# EAGLE schematic FRA_Sensor_v1 (EAGLE 9.6.2)
CNAME: FRA Sensor Unit; CREVISION: 06

## Sheet 1 of 5
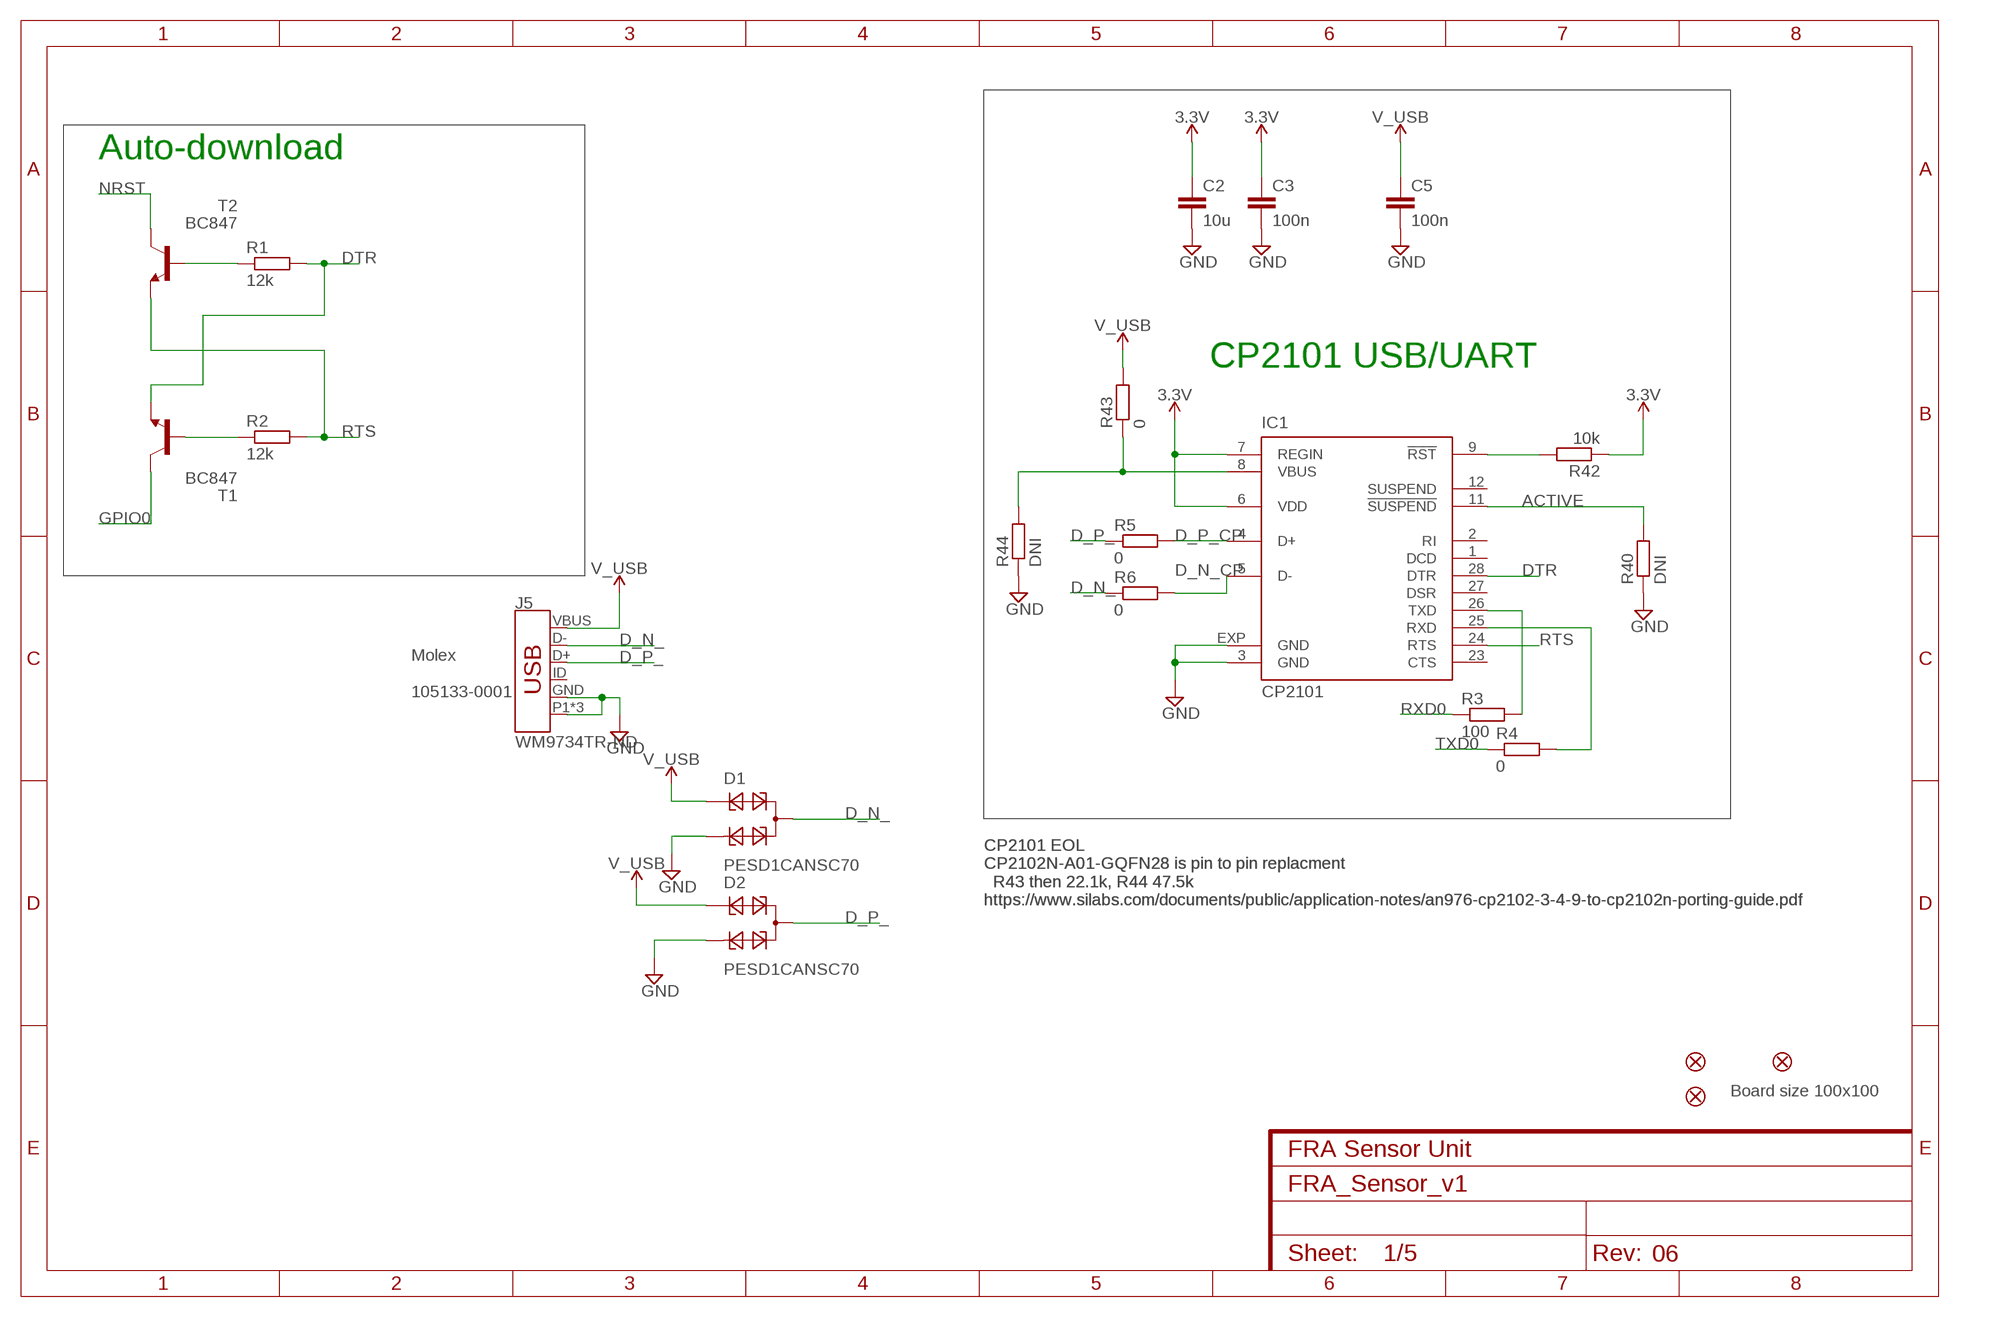
[diagram p0: schematic, sheet 1]

### Parts
C2  10u  C-EUC0603K  [C0603K]
C3  100n  C-EUC0603K  [C0603K]
C5  100n  C-EUC0603K  [C0603K]
D1  PESD1CANSC70  [SOT323-R]
D2  PESD1CANSC70  [SOT323-R]
FID1  FIDUCIAL""  [FIDUCIAL_1MM]
FID2  FIDUCIAL""  [FIDUCIAL_1MM]
FID4  FIDUCIAL""  [FIDUCIAL_1MM]
IC1  CP2101  CP210X_USB_UART  [MLP28]
J5  WM9734TR-ND  USB_MICRO-B_FEMALE-SMT-VERT  [USB-B-MICRO-SMD_VERT]
R1  12k  R-EU_R0603  [R0603]
R2  12k  R-EU_R0603  [R0603]
R3  100  R-EU_R0603  [R0603]
R4  0  R-EU_R0603  [R0603]
R5  0  R-EU_R0603  [R0603]
R6  0  R-EU_R0603  [R0603]
R40  DNI  R-EU_R0603  [R0603]
R42  10k  R-EU_R0603  [R0603]
R43  0  R-EU_R0603  [R0603]
R44  DNI  R-EU_R0603  [R0603]
T1  BC847  [SOT23]
T2  BC847  [SOT23]

### Nets
3.3V: C2.1 C3.1 IC1.6(VDD) IC1.7(REGIN) R42.1 ; also sheet 2,3,4
ACTIVE: IC1.11(!SUSPEND) R40.2
D_N_: D1.3 J5.D- R6.1
D_N_CP: IC1.5(D-) R6.2
D_P_: D2.3 J5.D+ R5.1
D_P_CP: IC1.4(D+) R5.2
DTR: IC1.28(DTR) R1.2 T1.2(E)
GND: C2.2 C3.2 C5.2 D1.2 D2.2 IC1.3(GND) IC1.EXP(GND) J5.GND J5.P1(SHIELD) J5.P2(SHIELD) J5.P3(SHIELD) R40.1 R44.1 ; also sheet 2,3,4
GPIO0: T1.3(C) ; also sheet 3
N$1: R1.1 T2.1(B)
N$2: R2.1 T1.1(B)
N$38: IC1.9(!RST) R42.2
N$39: IC1.8(VBUS) R43.1 R44.2
NRST: T2.3(C) ; also sheet 3
RTS: IC1.24(RTS) R2.2 T2.2(E)
RXD0: R3.1 ; also sheet 3
RXD0_CP2101IN: IC1.26(TXD) R3.2
TXD0: R4.1 ; also sheet 3
TXD0_CP2101: IC1.25(RXD) R4.2
V_USB: C5.1 D1.1 D2.1 J5.VBUS R43.2
Unconnected: IC1.1(DCD) IC1.2(RI) IC1.12(SUSPEND) IC1.23(CTS) IC1.27(DSR) J5.ID

### Notes on the sheet
- Auto-download
- CP2101 USB/UART
- Molex
  
  105133-0001
- CP2101 EOL
  CP2102N-A01-GQFN28 is pin to pin replacment
    R43 then 22.1k, R44 47.5k
  https://www.silabs.com/documents/public/application-notes/an976-cp2102-3-4-9-to-cp2102n-porting-guide.pdf
- CP2101 EOL
  CP2102N-A01-GQFN28 is pin to pin replacment
    R43 then 22.1k, R44 47.5k
  https://www.silabs.com/documents/public/application-notes/an976-cp2102-3-4-9-to-cp2102n-porting-guide.pdf
- Board size 100x100

## Sheet 2 of 5
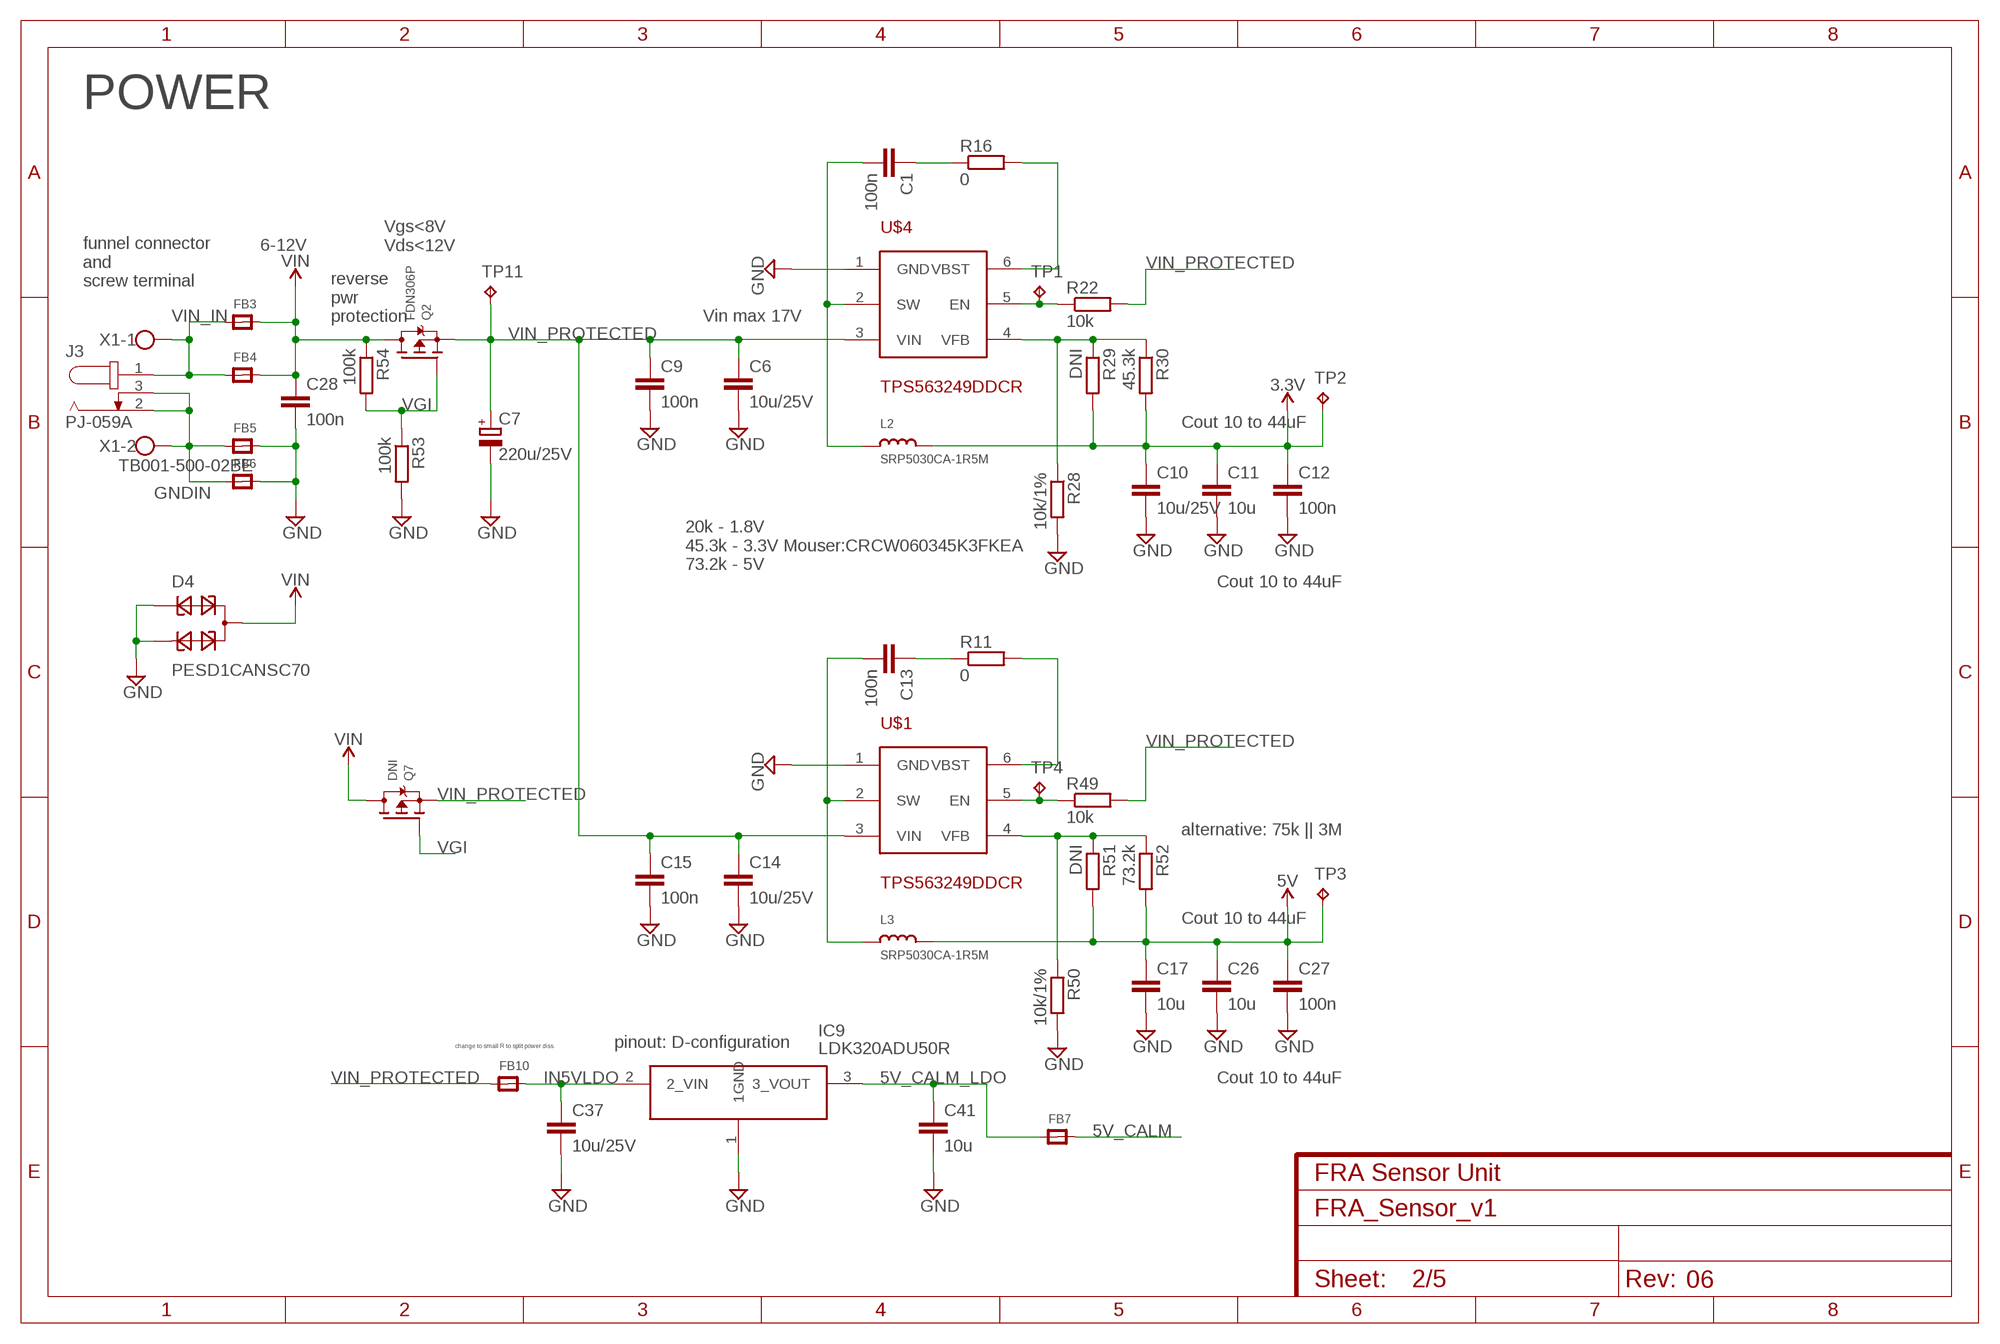
[diagram p1: schematic, sheet 2]

### Parts
C1  100n  C-EUC0603K  [C0603K]
C6  10u/25V  C-EUC0603K  [C0603K]
C7  220u/25V  CPOL-EU153CLV-0605  [153CLV-0605]
C9  100n  C-EUC0603K  [C0603K]
C10  10u/25V  C-EUC0603K  [C0603K]
C11  10u  C-EUC0603K  [C0603K]
C12  100n  C-EUC0603K  [C0603K]
C13  100n  C-EUC0603K  [C0603K]
C14  10u/25V  C-EUC0603K  [C0603K]
C15  100n  C-EUC0603K  [C0603K]
C17  10u  C-EUC0603K  [C0603K]
C26  10u  C-EUC0603K  [C0603K]
C27  100n  C-EUC0603K  [C0603K]
C28  100n  C-EUC0603K  [C0603K]
C37  10u/25V  C-EUC0603K  [C0603K]
C41  10u  C-EUC0603K  [C0603K]
D4  PESD1CANSC70  [SOT323-R]
FB3  FERRITE  [0603]
FB4  FERRITE  [0603]
FB5  FERRITE  [0603]
FB6  FERRITE  [0603]
FB7  FERRITE  [0603]
FB10  FERRITE  [0603]
IC9  LDK320ADU50R  [ST-SOT-89]
J3  PJ-059A  [PJ-059A]
L2  SRP5030CA-1R5M  [SRP5030CA]
L3  SRP5030CA-1R5M  [SRP5030CA]
Q2  FDN306P  MOSFET-PWIDE  [SOT23-WIDE]
Q7  DNI  MOSFET-PTO252  [TO252]
R11  0  R-EU_R0603  [R0603]
R16  0  R-EU_R0603  [R0603]
R22  10k  R-EU_R0603  [R0603]
R28  10k/1%  R-EU_R0603  [R0603]
R29  DNI  R-EU_R0603  [R0603]
R30  45.3k  R-EU_R0603  [R0603]
R49  10k  R-EU_R0603  [R0603]
R50  10k/1%  R-EU_R0603  [R0603]
R51  DNI  R-EU_R0603  [R0603]
R52  73.2k  R-EU_R0603  [R0603]
R53  100k  R-EU_R0603  [R0603]
R54  100k  R-EU_R0603  [R0603]
TP1  TPTP10R  [TP10R]
TP2  TPTP10R  [TP10R]
TP3  TPTP10R  [TP10R]
TP4  TPTP10R  [TP10R]
TP11  TPTP10R  [TP10R]
U$1  TPS563249DDCR  TPS5632149DDCR  [SOT23-6]
U$4  TPS563249DDCR  TPS5632149DDCR  [SOT23-6]
X1  TB001-500-02BE  W237-102  [W237-102]

### Nets
3.3V: C10.1 C11.1 C12.1 L2.P$2 R29.2 R30.2 TP2.TP ; also sheet 1,3,4
5V: C17.1 C26.1 C27.1 L3.P$2 R51.2 R52.2 TP3.TP ; also sheet 3,4
5V_CALM: FB7.2 ; also sheet 5
5V_CALM_LDO: C41.1 FB7.1 IC9.3(3_VOUT)
GND: C6.2 C7.- C9.2 C10.2 C11.2 C12.2 C14.2 C15.2 C17.2 C26.2 C27.2 C28.2 C37.2 C41.2 D4.1 D4.2 FB5.2 FB6.2 IC9.1(1GND) R28.2 R50.2 R53.2 U$1.1(GND) U$4.1(GND) ; also sheet 1,3,4
GNDIN: FB5.1 FB6.1 J3.2 J3.3 X1.2
IN5VLDO: C37.1 FB10.2 IC9.2(2_VIN)
N$3: C1.1 R16.1
N$11: C13.1 R11.1
N$15: R16.2 U$4.6(VBST)
N$19: C1.2 L2.P$1 U$4.2(SW)
N$20: R11.2 U$1.6(VBST)
N$21: C13.2 L3.P$1 U$1.2(SW)
N$22: R49.1 TP4.TP U$1.5(EN)
N$23: R22.1 TP1.TP U$4.5(EN)
N$24: R28.1 R29.1 R30.1 U$4.4(VFB)
N$25: R50.1 R51.1 R52.1 U$1.4(VFB)
VGI: Q2.1(G) Q7.1(G) R53.1 R54.2
VIN: C28.1 D4.3 FB3.2 FB4.2 Q2.3(D) Q7.3(D) R54.1
VIN_IN: FB3.1 FB4.1 J3.1 X1.1
VIN_PROTECTED: C6.1 C7.+ C9.1 C14.1 C15.1 FB10.1 Q2.2(S) Q7.2(S) R22.2 R49.2 TP11.TP U$1.3(VIN) U$4.3(VIN)

### Notes on the sheet
- POWER
- 6-12V
- Vgs<8V
  Vds<12V
- funnel connector
  and
  screw terminal
- reverse
  pwr
  protection
- Vin max 17V
- Cout 10 to 44uF
- 20k - 1.8V
  45.3k - 3.3V Mouser:CRCW060345K3FKEA
  73.2k - 5V
- Cout 10 to 44uF
- alternative: 75k || 3M
- Cout 10 to 44uF
- change to small R to split power diss. | pinout: D-configuration
- Cout 10 to 44uF

## Sheet 3 of 5
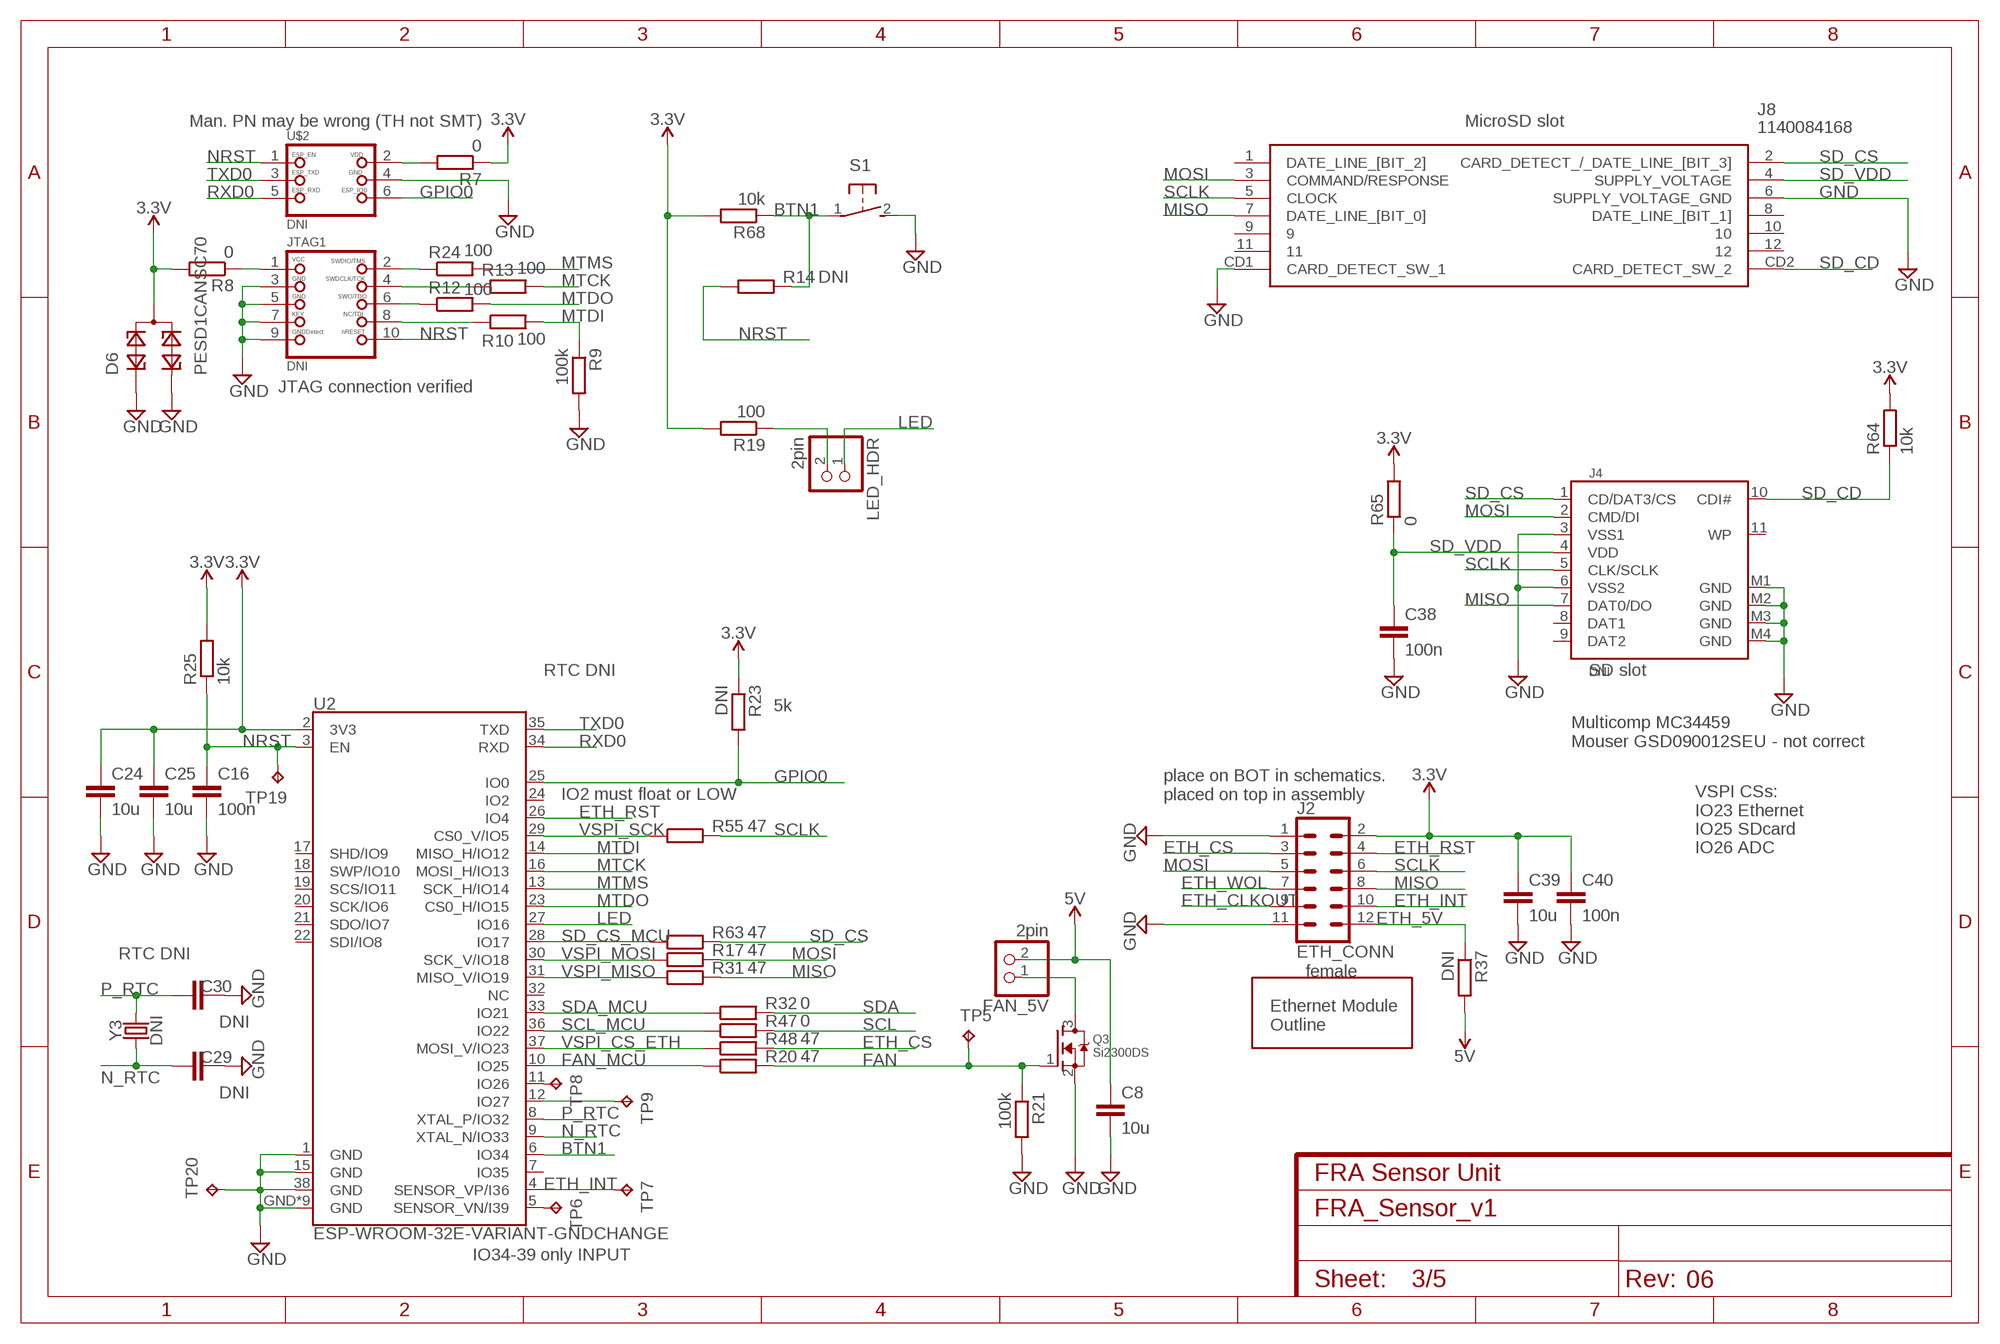
[diagram p2: schematic, sheet 3]

### Parts
C8  10u  C-EUC0603K  [C0603K]
C16  100n  C-EUC0603K  [C0603K]
C24  10u  C-EUC0603K  [C0603K]
C25  10u  C-EUC0603K  [C0603K]
C29  DNI  C-EUC0402  [C0402]
C30  DNI  C-EUC0402  [C0402]
C38  100n  C-EUC0603K  [C0603K]
C39  10u  C-EUC0603K  [C0603K]
C40  100n  C-EUC0603K  [C0603K]
D6  PESD1CANSC70  [SOT323-R]
FAN_5V  2pin  PINHD-1X2  [1X02]
J2  ETH_CONN  CONN_06X2PTH_FEMALE  [2X6]
J4  DNI  SDCARD  [SDCMF-10915W010]
J8  1140084168  [1140084168]
JTAG1  DNI  JTAG-CORTEXM3  [2X05_1.27MM_SMT]
LED_HDR  2pin  PINHD-1X2  [1X02]
Q3  Si2300DS  MOSFET-NREFLOW  [SOT23]
R7  0  R-EU_R0603  [R0603]
R8  0  R-EU_R0603  [R0603]
R9  100k  R-EU_R0603  [R0603]
R10  100  R-EU_R0603  [R0603]
R12  100  R-EU_R0603  [R0603]
R13  100  R-EU_R0603  [R0603]
R14  DNI  R-EU_R0603  [R0603]
R17  47  R-EU_R0603  [R0603]
R19  100  R-EU_R0603  [R0603]
R20  47  R-EU_R0603  [R0603]
R21  100k  R-EU_R0603  [R0603]
R23  DNI  R-EU_R0603  [R0603]
R24  100  R-EU_R0603  [R0603]
R25  10k  R-EU_R0603  [R0603]
R31  47  R-EU_R0603  [R0603]
R32  0  R-EU_R0603  [R0603]
R37  DNI  R-EU_R0603  [R0603]
R47  0  R-EU_R0603  [R0603]
R48  47  R-EU_R0603  [R0603]
R55  47  R-EU_R0603  [R0603]
R63  47  R-EU_R0603  [R0603]
R64  10k  R-EU_R0603  [R0603]
R65  0  R-EU_R0603  [R0603]
R68  10k  R-EU_R0603  [R0603]
S1  31-XX  [B3F-31XX]
TP5  TPTP10R  [TP10R]
TP6  TPTP10R  [TP10R]
TP7  TPTP10R  [TP10R]
TP8  TPTP10R  [TP10R]
TP9  TPTP10R  [TP10R]
TP19  TPTP10R  [TP10R]
TP20  TPTP10R  [TP10R]
U2  ESP-WROOM-32E-VARIANT-GNDCHANGE  [ESP-WROOM-32E]
U$2  DNI  HEADER_3X6P_ESPPROG  [2X03_1.27MM_SMT]
U$7  ETH_MODULE_OUTLINE  [ETH_MODULE_OUTLINE_SMALL]
Y3  DNI  CRYSTAL-32.768KHZSMD-3.2X1.5  [CRYSTAL-SMD-3.2X1.5MM]

### Nets
3.3V: C24.1 C25.1 C39.1 C40.1 D6.3 J2.2 R7.1 R8.2 R19.2 R23.1 R25.2 R64.2 R65.2 R68.2 U2.2(3V3) ; also sheet 1,2,4
5V: C8.1 FAN_5V.2 R37.2 ; also sheet 2,4
BTN1: R14.2 R68.1 S1.1(P) U2.6(IO34)
ETH_5V: J2.12 R37.1
ETH_CLKOUT: J2.9
ETH_CS: J2.3 R48.2
ETH_INT: J2.10 TP7.TP U2.4(SENSOR_VP/I36)
ETH_RST: J2.4 U2.26(IO4)
ETH_WOL: J2.7
FAN: Q3.1(G) R20.2 R21.1 TP5.TP
FAN_MCU: R20.1 U2.10(IO25)
GND: C8.2 C16.2 C24.2 C25.2 C29.2 C30.2 C38.2 C39.2 C40.2 D6.1 D6.2 J2.1 J2.11 J4.3(VSS1) J4.6(VSS2) J4.M1(GND) J4.M2(GND) J4.M3(GND) J4.M4(GND) J8.6(SUPPLY_VOLTAGE_GND) J8.CD1(CARD_DETECT_SW_1) JTAG1.3 JTAG1.5 JTAG1.7 JTAG1.9 Q3.2(S) R9.2 R21.2 S1.2(S) TP20.TP U2.1(GND) U2.15(GND) U2.38(GND) U2.GND U2.GND1(GND) U2.GND2(GND) U2.GND3(GND) U2.GND4(GND) U2.GND5(GND) U2.GND6(GND) U2.GND7(GND) U2.GND8(GND) U$2.4 ; also sheet 1,2,4
GPIO0: R23.2 U2.25(IO0) U$2.6 ; also sheet 1
LED: LED_HDR.1 U2.27(IO16)
MISO: J2.8 J4.7(DAT0/DO) J8.7(DATE_LINE_[BIT_0]) R31.2
MOSI: J2.5 J4.2(CMD/DI) J8.3(COMMAND/RESPONSE) R17.2
MTCK: R13.2 U2.16(MOSI_H/IO13)
MTDI: R9.1 R10.2 U2.14(MISO_H/IO12)
MTDO: R12.2 U2.23(CS0_H/IO15)
MTMS: R24.2 U2.13(SCK_H/IO14)
N$6: LED_HDR.2 R19.1
N$8: FAN_5V.1 Q3.3(D)
N$29: TP6.TP U2.5(SENSOR_VN/I39)
N$31: TP8.TP U2.11(IO26)
N$33: TP9.TP U2.12(IO27)
N_RTC: C29.1 U2.9(XTAL_N/IO33) Y3.P$1
NRST: C16.1 JTAG1.10 R14.1 R25.1 TP19.TP U2.3(EN) U$2.1 ; also sheet 1
P_RTC: C30.1 U2.8(XTAL_P/IO32) Y3.P$2
RXD0: U2.34(RXD) U$2.5 ; also sheet 1
SCL: R47.2 ; also sheet 4
SCL_MCU: R47.1 U2.36(IO22)
SCLK: J2.6 J4.5(CLK/SCLK) J8.5(CLOCK) R55.2
SD_CD: J4.10(CDI#) J8.CD2(CARD_DETECT_SW_2) R64.1
SD_CS: J4.1(CD/DAT3/CS) J8.2(CARD_DETECT_/_DATE_LINE_[BIT_3]) R63.2
SD_CS_MCU: R63.1 U2.28(IO17)
SD_VDD: C38.1 J4.4(VDD) J8.4(SUPPLY_VOLTAGE) R65.1
SDA: R32.2 ; also sheet 4
SDA_MCU: R32.1 U2.33(IO21)
TCKCONN: JTAG1.4 R13.1
TDICONN: JTAG1.8 R10.1
TDOCONN: JTAG1.6 R12.1
TMSCONN: JTAG1.2 R24.1
TXD0: U2.35(TXD) U$2.3 ; also sheet 1
VCCJTAG: JTAG1.1 R8.1
VDDPROG: R7.2 U$2.2
VSPI_CS_ETH: R48.1 U2.37(MOSI_V/IO23)
VSPI_MISO: R31.1 U2.31(MISO_V/IO19)
VSPI_MOSI: R17.1 U2.30(SCK_V/IO18)
VSPI_SCK: R55.1 U2.29(CS0_V/IO5)
Unconnected: J4.8(DAT1) J4.9(DAT2) J4.11(WP) J8.1(DATE_LINE_[BIT_2]) J8.8(DATE_LINE_[BIT_1]) J8.9 J8.10 J8.11 J8.12 U2.7(IO35) U2.17(SHD/IO9) U2.18(SWP/IO10) U2.19(SCS/IO11) U2.20(SCK/IO6) U2.21(SDO/IO7) U2.22(SDI/IO8) U2.24(IO2) U2.32(NC)

### Notes on the sheet
- Man. PN may be wrong (TH not SMT) | MicroSD slot
- JTAG connection verified
- RTC DNI | SD slot
- 5k
- Multicomp MC34459
  Mouser GSD090012SEU - not correct
- IO2 must float or LOW
- place on BOT in schematics.
  placed on top in assembly
- VSPI CSs:
  IO23 Ethernet
  IO25 SDcard
  IO26 ADC
- RTC DNI
- female
- IO34-39 only INPUT

## Sheet 4 of 5
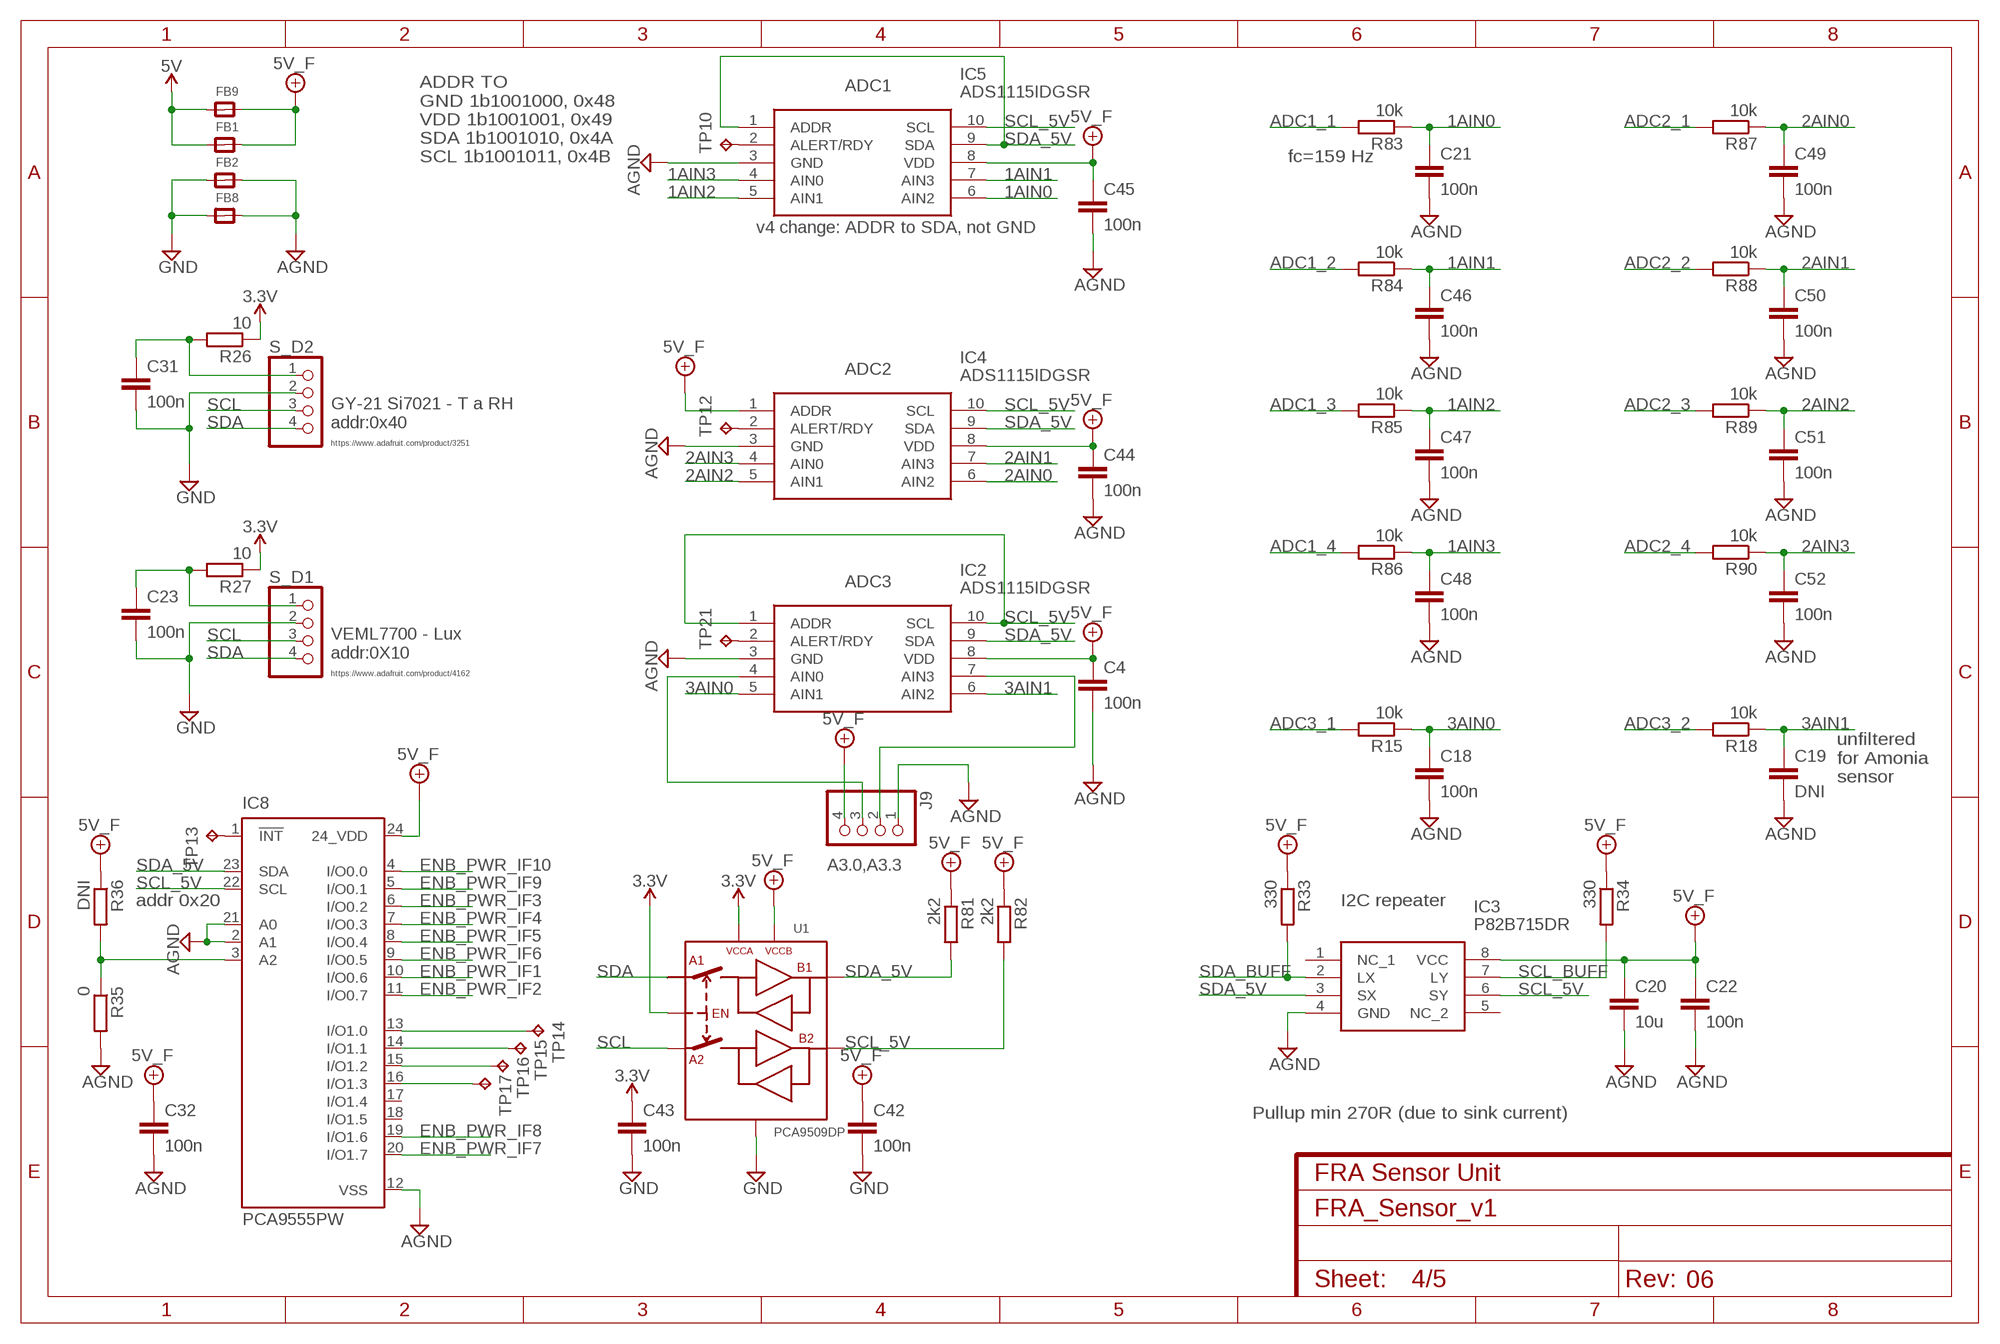
[diagram p3: schematic, sheet 4]

### Parts
C4  100n  C-EUC0603K  [C0603K]
C18  100n  C-EUC0603K  [C0603K]
C19  DNI  C-EUC0603K  [C0603K]
C20  10u  C-EUC0603K  [C0603K]
C21  100n  C-EUC0603K  [C0603K]
C22  100n  C-EUC0603K  [C0603K]
C23  100n  C-EUC0603K  [C0603K]
C31  100n  C-EUC0603K  [C0603K]
C32  100n  C-EUC0603K  [C0603K]
C42  100n  C-EUC0603K  [C0603K]
C43  100n  C-EUC0603K  [C0603K]
C44  100n  C-EUC0603K  [C0603K]
C45  100n  C-EUC0603K  [C0603K]
C46  100n  C-EUC0603K  [C0603K]
C47  100n  C-EUC0603K  [C0603K]
C48  100n  C-EUC0603K  [C0603K]
C49  100n  C-EUC0603K  [C0603K]
C50  100n  C-EUC0603K  [C0603K]
C51  100n  C-EUC0603K  [C0603K]
C52  100n  C-EUC0603K  [C0603K]
FB1  FERRITE  [0603]
FB2  FERRITE  [0603]
FB8  FERRITE  [0603]
FB9  FERRITE  [0603]
IC2  ADS1115IDGSR  ADS1115BQDGSRQ1  [SOP50P490X110-10N]
IC3  P82B715DR  [SOIC127P600X175-8N]
IC4  ADS1115IDGSR  ADS1115BQDGSRQ1  [SOP50P490X110-10N]
IC5  ADS1115IDGSR  ADS1115BQDGSRQ1  [SOP50P490X110-10N]
IC8  PCA9555PW  [TSSOP24]
J9  4pin  PINHD-1X4  [1X04]
R15  10k  R-EU_R0603  [R0603]
R18  10k  R-EU_R0603  [R0603]
R26  10  R-EU_R0603  [R0603]
R27  10  R-EU_R0603  [R0603]
R33  330  R-EU_R0603  [R0603]
R34  330  R-EU_R0603  [R0603]
R35  0  R-EU_R0603  [R0603]
R36  DNI  R-EU_R0603  [R0603]
R81  2k2  R-EU_R0603  [R0603]
R82  2k2  R-EU_R0603  [R0603]
R83  10k  R-EU_R0603  [R0603]
R84  10k  R-EU_R0603  [R0603]
R85  10k  R-EU_R0603  [R0603]
R86  10k  R-EU_R0603  [R0603]
R87  10k  R-EU_R0603  [R0603]
R88  10k  R-EU_R0603  [R0603]
R89  10k  R-EU_R0603  [R0603]
R90  10k  R-EU_R0603  [R0603]
S_D1  4pin  PINHD-1X4  [1X04]
S_D2  4pin  PINHD-1X4  [1X04]
TP10  TPTP10R  [TP10R]
TP12  TPTP10R  [TP10R]
TP13  TPTP10R  [TP10R]
TP14  TPTP10R  [TP10R]
TP15  TPTP10R  [TP10R]
TP16  TPTP10R  [TP10R]
TP17  TPTP10R  [TP10R]
TP21  TPTP10R  [TP10R]
U1  PCA9509DP  [SOT505-1]

### Nets
1AIN0: C21.1 IC5.6(AIN2) R83.1
1AIN1: C46.1 IC5.7(AIN3) R84.1
1AIN2: C47.1 IC5.5(AIN1) R85.1
1AIN3: C48.1 IC5.4(AIN0) R86.1
2AIN0: C49.1 IC4.6(AIN2) R87.1
2AIN1: C50.1 IC4.7(AIN3) R88.1
2AIN2: C51.1 IC4.5(AIN1) R89.1
2AIN3: C52.1 IC4.4(AIN0) R90.1
3.3V: C43.1 R26.1 R27.1 U1.1(VCC(A)) U1.5(EN) ; also sheet 1,2,3
3AIN0: C18.1 IC2.5(AIN1) R15.1
3AIN1: C19.1 IC2.6(AIN2) R18.1
5V: FB1.1 FB9.1 ; also sheet 2,3
+5V/1: C4.1 C20.1 C22.1 C32.1 C42.1 C44.1 C45.1 FB1.2 FB9.2 IC2.8(VDD) IC3.8(VCC) IC4.1(ADDR) IC4.8(VDD) IC5.8(VDD) IC8.24(24_VDD) J9.4 R33.1 R34.1 R36.1 R81.1 R82.1 U1.8(VCC(B)) ; supply symbol labelled 5V_F ; also sheet 5
ADC1_1: R83.2 ; also sheet 5
ADC1_2: R84.2 ; also sheet 5
ADC1_3: R85.2 ; also sheet 5
ADC1_4: R86.2 ; also sheet 5
ADC2_1: R87.2 ; also sheet 5
ADC2_2: R88.2 ; also sheet 5
ADC2_3: R89.2 ; also sheet 5
ADC2_4: R90.2 ; also sheet 5
ADC3_1: R15.2 ; also sheet 5
ADC3_2: R18.2 ; also sheet 5
AGND: C4.2 C18.2 C19.2 C20.2 C21.2 C22.2 C32.2 C44.2 C45.2 C46.2 C47.2 C48.2 C49.2 C50.2 C51.2 C52.2 FB2.2 FB8.2 IC2.3(GND) IC3.4(GND) IC4.3(GND) IC5.3(GND) IC8.2(A1) IC8.12(VSS) IC8.21(A0) J9.1 R35.2 ; also sheet 5
ENB_PWR_IF1: IC8.10(I/O0.6) ; also sheet 5
ENB_PWR_IF2: IC8.11(I/O0.7) ; also sheet 5
ENB_PWR_IF3: IC8.6(I/O0.2) ; also sheet 5
ENB_PWR_IF4: IC8.7(I/O0.3) ; also sheet 5
ENB_PWR_IF5: IC8.8(I/O0.4) ; also sheet 5
ENB_PWR_IF6: IC8.9(I/O0.5) ; also sheet 5
ENB_PWR_IF7: IC8.20(I/O1.7) ; also sheet 5
ENB_PWR_IF8: IC8.19(I/O1.6) ; also sheet 5
ENB_PWR_IF9: IC8.5(I/O0.1) ; also sheet 5
ENB_PWR_IF10: IC8.4(I/O0.0) ; also sheet 5
GND: C23.2 C31.2 C42.2 C43.2 FB2.1 FB8.1 S_D1.2 S_D2.2 U1.4(GND) ; also sheet 1,2,3
N$4: C23.1 R27.2 S_D1.1
N$5: C31.1 R26.2 S_D2.1
N$7: IC2.2(ALERT/RDY) TP21.TP
N$9: IC8.13(I/O1.0) TP14.TP
N$10: IC8.14(I/O1.1) TP15.TP
N$12: IC8.15(I/O1.2) TP16.TP
N$13: IC8.16(I/O1.3) TP17.TP
N$14: IC2.4(AIN0) J9.3
N$16: IC2.7(AIN3) J9.2
N$17: IC8.3(A2) R35.1 R36.2
N$37: IC4.2(ALERT/RDY) TP12.TP
N$40: IC5.2(ALERT/RDY) TP10.TP
N$41: IC8.1(!INT) TP13.TP
SCL: S_D1.3 S_D2.3 U1.3(A2) ; also sheet 3
SCL_5V: IC2.1(ADDR) IC2.10(SCL) IC3.6(SY) IC4.10(SCL) IC5.10(SCL) IC8.22(SCL) R82.2 U1.6(B2)
SCL_BUFF: IC3.7(LY) R34.2 ; also sheet 5
SDA: S_D1.4 S_D2.4 U1.2(A1) ; also sheet 3
SDA_5V: IC2.9(SDA) IC3.3(SX) IC4.9(SDA) IC5.1(ADDR) IC5.9(SDA) IC8.23(SDA) R81.2 U1.7(B1)
SDA_BUFF: IC3.2(LX) R33.2 ; also sheet 5
Unconnected: IC3.1(NC_1) IC3.5(NC_2) IC8.17(I/O1.4) IC8.18(I/O1.5)

### Notes on the sheet
- ADC1
- ADDR TO
  GND 1b1001000, 0x48
  VDD 1b1001001, 0x49
  SDA 1b1001010, 0x4A
  SCL 1b1001011, 0x4B
- fc=159 Hz
- v4 change: ADDR to SDA, not GND
- ADC2
- GY-21 Si7021 - T a RH 
  addr:0x40
- https://www.adafruit.com/product/3251
- ADC3
- VEML7700 - Lux
  addr:0X10
- https://www.adafruit.com/product/4162
- unfiltered
  for Amonia
  sensor
- A3.0,A3.3
- addr 0x20 | I2C repeater
- Pullup min 270R (due to sink current)

## Sheet 5 of 5
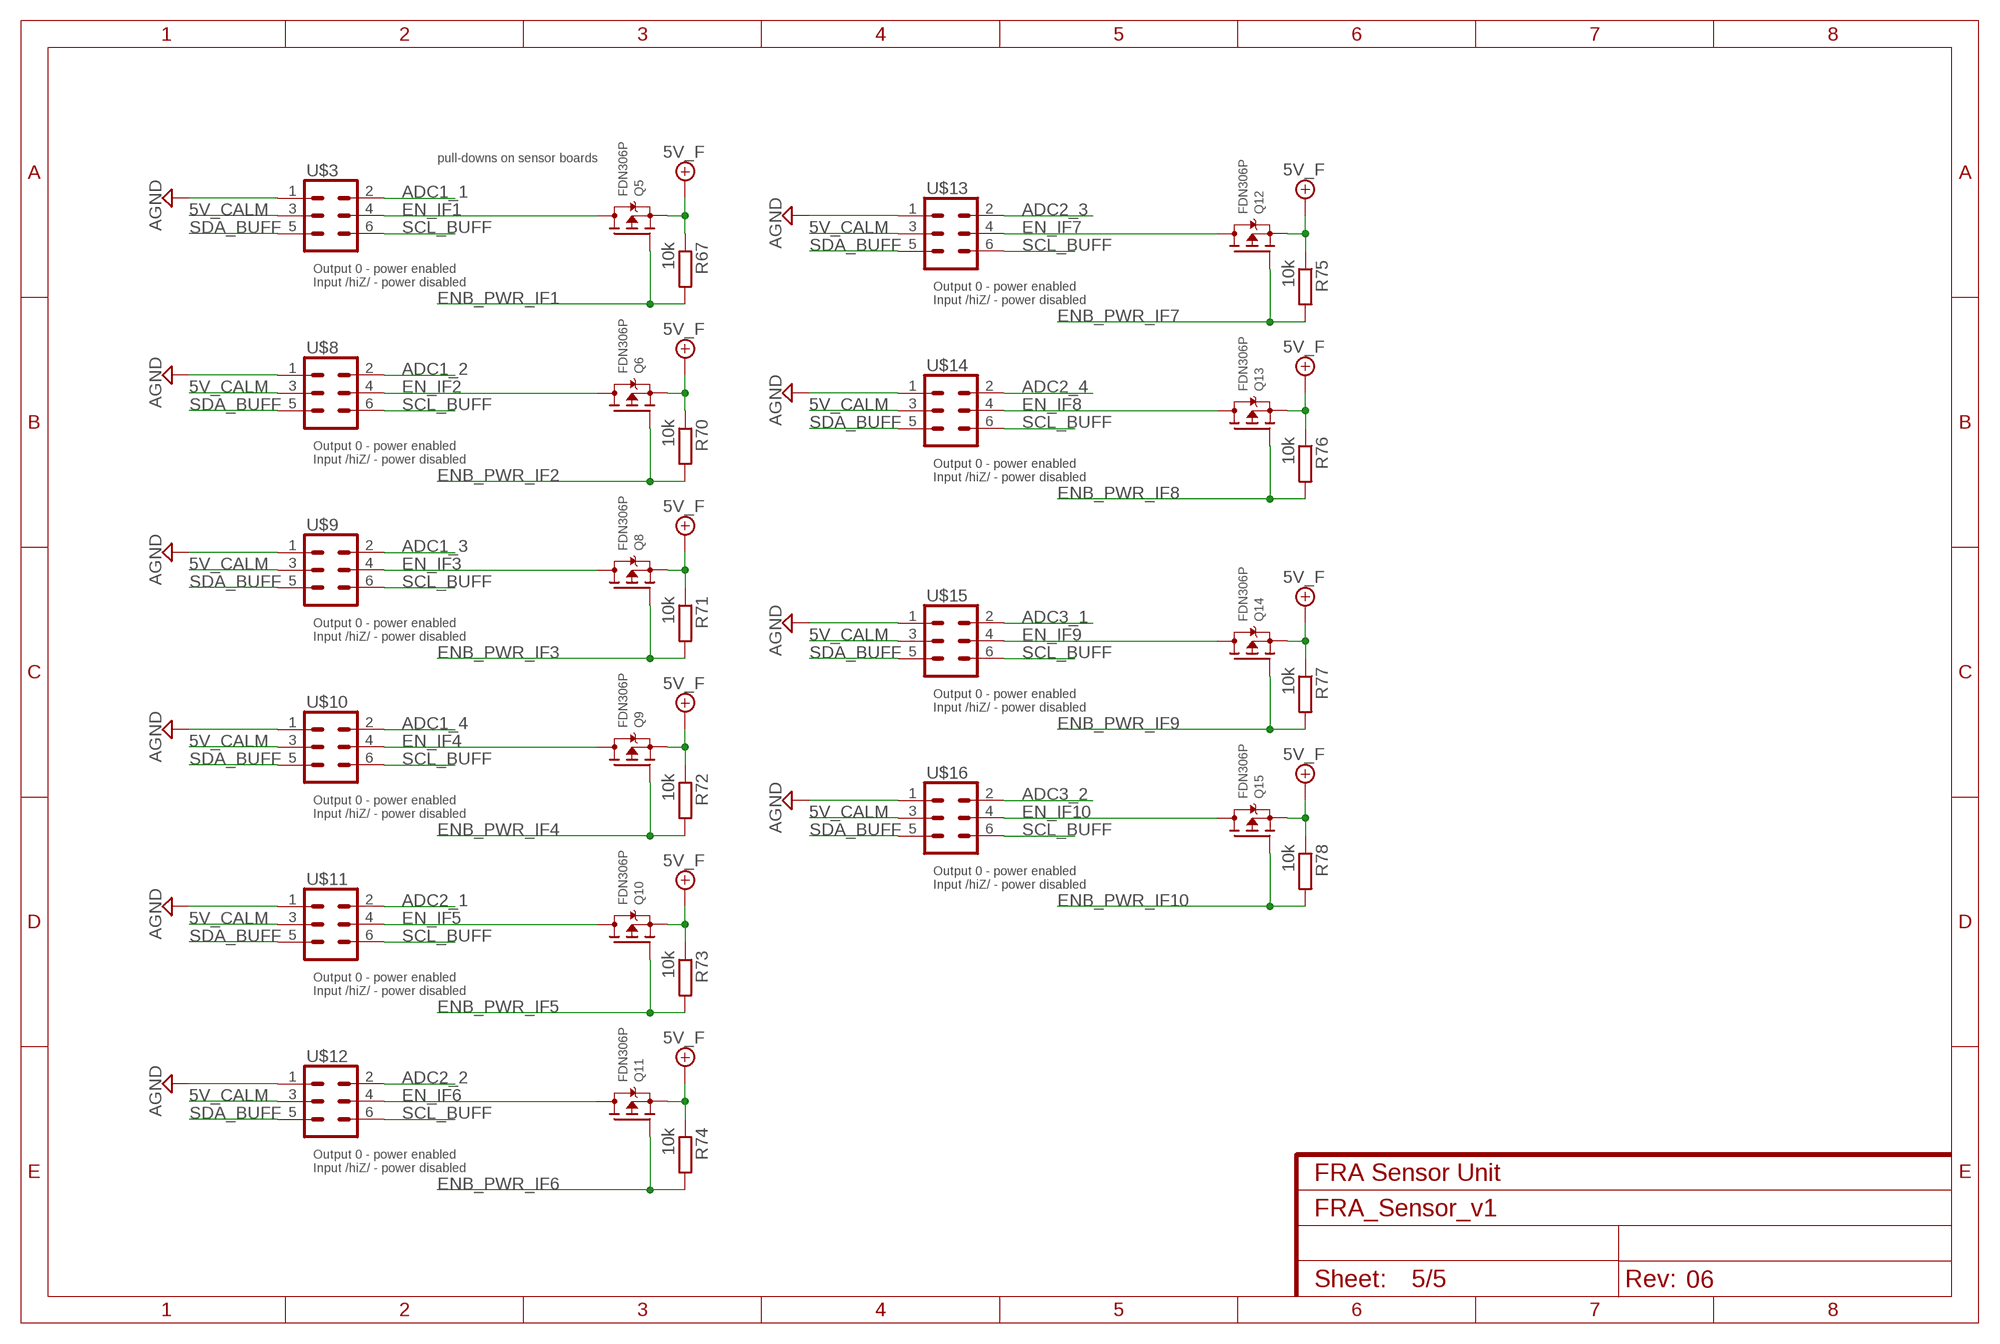
[diagram p4: schematic, sheet 5]

### Parts
Q5  FDN306P  MOSFET-PWIDE  [SOT23-WIDE]
Q6  FDN306P  MOSFET-PWIDE  [SOT23-WIDE]
Q8  FDN306P  MOSFET-PWIDE  [SOT23-WIDE]
Q9  FDN306P  MOSFET-PWIDE  [SOT23-WIDE]
Q10  FDN306P  MOSFET-PWIDE  [SOT23-WIDE]
Q11  FDN306P  MOSFET-PWIDE  [SOT23-WIDE]
Q12  FDN306P  MOSFET-PWIDE  [SOT23-WIDE]
Q13  FDN306P  MOSFET-PWIDE  [SOT23-WIDE]
Q14  FDN306P  MOSFET-PWIDE  [SOT23-WIDE]
Q15  FDN306P  MOSFET-PWIDE  [SOT23-WIDE]
R67  10k  R-EU_R0603  [R0603]
R70  10k  R-EU_R0603  [R0603]
R71  10k  R-EU_R0603  [R0603]
R72  10k  R-EU_R0603  [R0603]
R73  10k  R-EU_R0603  [R0603]
R74  10k  R-EU_R0603  [R0603]
R75  10k  R-EU_R0603  [R0603]
R76  10k  R-EU_R0603  [R0603]
R77  10k  R-EU_R0603  [R0603]
R78  10k  R-EU_R0603  [R0603]
U$3  CONN_03X2_WE_61200621621  [WE_61200621621]
U$8  CONN_03X2_WE_61200621621  [WE_61200621621]
U$9  CONN_03X2_WE_61200621621  [WE_61200621621]
U$10  CONN_03X2_WE_61200621621  [WE_61200621621]
U$11  CONN_03X2_WE_61200621621  [WE_61200621621]
U$12  CONN_03X2_WE_61200621621  [WE_61200621621]
U$13  CONN_03X2_WE_61200621621  [WE_61200621621]
U$14  CONN_03X2_WE_61200621621  [WE_61200621621]
U$15  CONN_03X2_WE_61200621621  [WE_61200621621]
U$16  CONN_03X2_WE_61200621621  [WE_61200621621]

### Nets
5V_CALM: U$3.3 U$8.3 U$9.3 U$10.3 U$11.3 U$12.3 U$13.3 U$14.3 U$15.3 U$16.3 ; also sheet 2
+5V/1: Q5.2(S) Q6.2(S) Q8.2(S) Q9.2(S) Q10.2(S) Q11.2(S) Q12.2(S) Q13.2(S) Q14.2(S) Q15.2(S) R67.1 R70.1 R71.1 R72.1 R73.1 R74.1 R75.1 R76.1 R77.1 R78.1 ; supply symbol labelled 5V_F ; also sheet 4
ADC1_1: U$3.2 ; also sheet 4
ADC1_2: U$8.2 ; also sheet 4
ADC1_3: U$9.2 ; also sheet 4
ADC1_4: U$10.2 ; also sheet 4
ADC2_1: U$11.2 ; also sheet 4
ADC2_2: U$12.2 ; also sheet 4
ADC2_3: U$13.2 ; also sheet 4
ADC2_4: U$14.2 ; also sheet 4
ADC3_1: U$15.2 ; also sheet 4
ADC3_2: U$16.2 ; also sheet 4
AGND: U$3.1 U$8.1 U$9.1 U$10.1 U$11.1 U$12.1 U$13.1 U$14.1 U$15.1 U$16.1 ; also sheet 4
EN_IF1: Q5.3(D) U$3.4
EN_IF2: Q6.3(D) U$8.4
EN_IF3: Q8.3(D) U$9.4
EN_IF4: Q9.3(D) U$10.4
EN_IF5: Q10.3(D) U$11.4
EN_IF6: Q11.3(D) U$12.4
EN_IF7: Q12.3(D) U$13.4
EN_IF8: Q13.3(D) U$14.4
EN_IF9: Q14.3(D) U$15.4
EN_IF10: Q15.3(D) U$16.4
ENB_PWR_IF1: Q5.1(G) R67.2 ; also sheet 4
ENB_PWR_IF2: Q6.1(G) R70.2 ; also sheet 4
ENB_PWR_IF3: Q8.1(G) R71.2 ; also sheet 4
ENB_PWR_IF4: Q9.1(G) R72.2 ; also sheet 4
ENB_PWR_IF5: Q10.1(G) R73.2 ; also sheet 4
ENB_PWR_IF6: Q11.1(G) R74.2 ; also sheet 4
ENB_PWR_IF7: Q12.1(G) R75.2 ; also sheet 4
ENB_PWR_IF8: Q13.1(G) R76.2 ; also sheet 4
ENB_PWR_IF9: Q14.1(G) R77.2 ; also sheet 4
ENB_PWR_IF10: Q15.1(G) R78.2 ; also sheet 4
SCL_BUFF: U$3.6 U$8.6 U$9.6 U$10.6 U$11.6 U$12.6 U$13.6 U$14.6 U$15.6 U$16.6 ; also sheet 4
SDA_BUFF: U$3.5 U$8.5 U$9.5 U$10.5 U$11.5 U$12.5 U$13.5 U$14.5 U$15.5 U$16.5 ; also sheet 4

### Notes on the sheet
- pull-downs on sensor boards
- Output 0 - power enabled
  Input /hiZ/ - power disabled
- Output 0 - power enabled
  Input /hiZ/ - power disabled
- Output 0 - power enabled
  Input /hiZ/ - power disabled
- Output 0 - power enabled
  Input /hiZ/ - power disabled
- Output 0 - power enabled
  Input /hiZ/ - power disabled
- Output 0 - power enabled
  Input /hiZ/ - power disabled
- Output 0 - power enabled
  Input /hiZ/ - power disabled
- Output 0 - power enabled
  Input /hiZ/ - power disabled
- Output 0 - power enabled
  Input /hiZ/ - power disabled
- Output 0 - power enabled
  Input /hiZ/ - power disabled

## Library data of the parts
C1 C3-C5 C9 C12 C13 C15 C16 C18 C19 C21-C23 C27 C28 C31 C32 C38 C40 C42-C52 = resistor:C-EU: CAPACITOR, European symbol; PARTNO: CC0603KRX7R8BB104
C2 C8 C11 C17 C20 C24-C26 C39 C41 = resistor:C-EU: CAPACITOR, European symbol; PARTNO: GRM188R61A106KE69J
C6 C10 C14 C37 = resistor:C-EU: CAPACITOR, European symbol; PARTNO: GRM188R61E106KA73J
C7 = resistor:CPOL-EU: POLARIZED CAPACITOR, European symbol; PARTNO: EMZR250ARA221MF80G
C29 C30 = resistor:C-EU: CAPACITOR, European symbol; PARTNO: C0402C220J5GAC7411
D1 D2 D4 D6 = diode:PESD1CAN: CAN bus ESD protection diode Source: http://www.nxp.com/documents/data_sheet/PESD1CAN.pdf; PARTNO: PESD1CAN-UX
FAN_5V LED_HDR = pinhead:PINHD-1X2: PIN HEADER; PARTNO: TSW-102-07-G-S
FB1-FB10 = microbuilder:FERRITE: Ferrite Bead 0603 MMZ1608B121C - 120 Ohm @ 100MHz, 600mA, 0.15 Ohm DC Resistance - Digikey: 445-2164-1-ND BK1608HW121-T - 120 Ohm, 600mA Ferrite Chip - Digikey: 587-1876-2-ND 0805 HZ0805B272R-10 - 2.7K Ohm @ 100MHz, 200mA, 0.8 Ohm DC Resistance - Digikey: 240-2504-1-ND (see also Murata BLM21BD272SN1L) MMZ2012Y152B - 1.5K Ohm @ 100MHz, 500mA, 0.4 Ohm DC Resistance - Digikey: 445-1560-1-ND - Mainly for high frequency (80-400MHz) MMZ2012R102A - 1K Ohm @ 100MHz, 500mA, 0.3 Ohm DC Resistance - Digikey: 445-1555-2-ND - More general purpose (10-200MHz); PARTNO: BLM18PG121SN1D
FID1 FID2 FID4 = microbuilder:FIDUCIAL: Fiducial Alignment Points Various fiducial points for machine vision alignment.
IC1 = SparkFun-Retired:CP210X_USB_UART: Single-Chip USB to UART Bridge Source: www.silabs.com .. CP2101.pdf / cp2102.pdf. Spark Fun Electronics SKU : COM-00310 RETIRED: IC-00865; PARTNO: CP2101-GM; PROD_ID: COM-00310
IC2 IC4 IC5 = SamacSys_Parts:ADS1115BQDGSRQ1: Automotive 16-Bit 860SPS 4-Ch Delta-Sigma ADC With PGA, Oscillator, VREF, Comparator, and I2C Source: Datasheet <http://www.ti.com/lit/gpn/ads1115-q1>; DESCRIPTION: Automotive 16-Bit 860SPS 4-Ch Delta-Sigma ADC With PGA, Oscillator, VREF, Comparator, and I2C; HEIGHT: 1.1mm; MANUFACTURER_NAME: Texas Instruments; MANUFACTURER_PART_NUMBER: ADS1115BQDGSRQ1; MOUSER_PART_NUMBER: 595-ADS1115BQDGSRQ1; MOUSER_PRICE-STOCK: https://www.mouser.com/Search/Refine.aspx?Keyword=595-ADS1115BQDGSRQ1; PARTNO: ADS1115IDGSR
IC3 = SamacSys_Parts:P82B715DR: I2C Bus Extender Source: Datasheet <http://www.ti.com/lit/gpn/p82b715>; DESCRIPTION: I2C Bus Extender; HEIGHT: 1.75mm; MANUFACTURER_NAME: Texas Instruments; MANUFACTURER_PART_NUMBER: P82B715DR; PARTNO: P82B715DR
IC8 = micro-philips:PCA9555: 16-bit I2C and SMBus I/O port with interrupt Source: PCA9555_5.pdf; MPN: PCA9555PW; OC_FARNELL: 1408297; OC_NEWARK: 63K6069; PARTNO: PCA9555PW,118
IC9 = SamacSys_Parts:LDK320ADU50R: LDO Voltage Regulators 200 mA low quiescent current and high PSRR voltage regulator Source: Datasheet <https://componentsearchengine.com/Datasheets/1/LDK320ADU50R.pdf> D configuration pinut!!!; DESCRIPTION: LDO Voltage Regulators 200 mA low quiescent current and high PSRR voltage regulator; HEIGHT: mm; MANUFACTURER_NAME: STMicroelectronics; MANUFACTURER_PART_NUMBER: LDK320ADU50R; MOUSER_PART_NUMBER: 511-LDK320ADU50R; MOUSER_PRICE-STOCK: https://www.mouser.com/Search/Refine.aspx?Keyword=511-LDK320ADU50R; PARTNO: LDK320ADU50R
J2 = SparkFun-Connectors:CONN_06X2: Multi connection point. Often used as Generic Header-pin footprint for 0.1 inch spaced/style header connections On any of the 0.1 inch spaced packages, you can populate with these: Break Away Headers - Straight <https://www.sparkfun.com/products/116> (PRT-00116) Break Away Male Headers - Right Angle <https://www.sparkfun.com/products/553> (PRT-00553) Female Headers <https://www.sparkfun.com/products/115> (PRT-00115) Break Away Headers - Machine Pin <https://www.sparkfun.com/products/117> (PRT-00117) Break Away Female Headers - Swiss Machine Pin <https://www.sparkfun.com/products/743> (PRT-00743); PARTNO: CES-106-01-T-D; PROD_ID: CONN-12423; VALUE: 2X6 FEMALE
J3 = FRA_eagle_lib:PJ-059A: DC Power Connectors Power Jacks Source: Datasheet <https://www.mouser.com/datasheet/2/670/pj-059a-1312938.pdf>; DESCRIPTION: DC Power Connectors Power Jacks; HEIGHT: 11mm; MANUFACTURER_NAME: CUI; MANUFACTURER_PART_NUMBER: PJ-059A; MOUSER_PRICE-STOCK: https://www.mouser.com/ProductDetail/CUI/PJ-059A?qs=sGAEpiMZZMtnOp%252BbbqA009lE0K0K%252BPZGgL2j%2Fo1XCBQtBpzQrCB9dQ%3D%3D; PARTNO: PJ-059A
J4 = sd-mmc:SDCARD: SD card connector KINGFONT SDCMF-10915W010 https://cz.farnell.com/multicomp/mc34459/connector-sd-metal-cover-smt-r/dp/9186158?rpsku=rel3%3ASDCMF10915W010&st=SDCMF-10915W010; PARTNO: GSD090012SEU
J5 = SparkFun-Connectors:USB_MICRO-B: USB Type Micro-B Connector Male/female and PTH/SMT variants SparkFun Products: SparkFun microB USB Breakout <https://www.sparkfun.com/products/12035> SparkFun USB microB Plug Breakout <https://www.sparkfun.com/products/10031> SparkFun ESP8266 Thing <https://www.sparkfun.com/products/13231>; PARTNO: 105133-0001; PROD_ID: CONN-13534
J8 = SamacSys_Parts:1140084168: Memory Card Connectors Micro SD 8 Pin PCB Gold Source: Datasheet <https://www.mouser.es/datasheet/2/18/11400841-1156069.pdf>; DESCRIPTION: Memory Card Connectors Micro SD 8 Pin PCB Gold; HEIGHT: 1.68mm; MANUFACTURER_NAME: Amphenol; MANUFACTURER_PART_NUMBER: 1140084168; MOUSER_PART_NUMBER: 523-114-00841-68; PARTNO: 1140084168
J9 S_D1 S_D2 = pinhead:PINHD-1X4: PIN HEADER; PARTNO: 61300411121
JTAG1 = microbuilder:JTAG-CORTEXM3: Serial Wire (SW-DP) Connector This standard 0.05" 10-pin connector is for use with the Cortex M0/M3's native SWD (serial wire debugger) interface (SW-DP). Some boards support a 20-pin combined JTAG+SWD connector (SWJ-DP), such as the LPC1700 family, but many smaller devices only work with SWD which typically use the smaller 10-pin SW-DP connecter (the LPC1300 family, for example, only supports SWD). 2x05 1.27mm/0.05" Connector: This is the standard SMT connector defined by ARM for all Cortex devices, and should be used in most situations and for forward-compatibility since any new devices coming to market will likely use this connector. MOLEX 10 Pin 0.1" Connector: This 0.1" 10 pin connector has the same pin layout as the standard 0.05" connector, but is easier to work with if you are using standard jumper wires or custom cables to connect your SWD hardware. MOLEX 20 Pin 0.1" Connector: This 0.1" 20 pin connector is the same model used for ARM7/ARM9 JTAG debuggers, but is connected to match the pins on the Segger J-Link for ARM (which supports both JTAG and SWD debugging). See the following document from ARM for more information on Cortex M3 Debug Connectors: http://infocenter.arm.com/help/topic/com.arm.doc.faqs/attached/13634/cortex_debug_connectors.pdf And the following page for an overview with images of the different connector types: http://www.keil.com/peripherals/coresight/connectors.asp; PARTNO: M50-3600542R
L2 L3 = FRA_eagle_lib:SRP5030CA-1R5M: https://www.bourns.com/docs/Product-Datasheets/SRP5030CA.pdf https://www.mouser.com/ProductDetail/Bourns/SRP5030CA-1R5M?qs=%2Fha2pyFadui7REpqWHuidBV20ENgXdYStxO18hOBLFz1Bpqagkv5Sg%3D%3D; PARTNO: SRP5030CA-1R5M
Q2 Q5 Q6 Q8-Q15 = microbuilder:MOSFET-P: P-Channel Mosfet LEGEND VDS: Voltage Drain-Source ID: Drain Current RDS(ON): Drain-Source On-State Resistance VGS(TH): Gate-Source Threshold Voltage CISS: Drain-Source Input Capacitance SOT-23 Name VDS ID RDS(ON) VGS(TH) CISS Order Number IRLML5103 30V 760mA 600 mOhm -- 75pF @ 25V Digikey: IRLML5103PBFCT-ND IRLML6401 12V 4.3A 50 mOhm 950mV @ 250µA 830pF @ 10V Digikey: IRLML6401PBFTR-ND NTR0202PL 20V 400mA 800 mOhm 2.3V @ 250uA 70pF @ 5V Digikey: NTR0202PLT1GOSTR-ND NTR4101PT1G 20V 1.8A 85 mOhm 1.2V @ 250uA 675pF @ 10V Digikey: NTR4101PT1GOSCT-ND DMP2004K 20V 600mA 900 mOhm 1V @ 250uA 175pF @ 16V Digikey: DMP2004KDICT-ND PMV65XP 20V 3.9A 76 mOhm 950mV @ 1mA 725pF @ 20V Digikey: 568-2358-2-ND TO-252 Name VDS ID RDS(ON) VGS(TH) CISS Order Number AOD417 30V 25A 34 mOhm 3V @ 250µA 920pF @ 15V Digikey: 785-1106-2-ND; PARTNO: FDN306P
Q3 = adafruit:MOSFET-N: N-Channel Mosfet 2N7002E - 60V 260mA SOT23 [Digikey: 2N7002ET1GOSTR-ND] - REEL BSH103 - 30V 850mA SOT23 [Digikey: 568-5013-1-ND]; PARTNO: SI2300DS-T1-GE3
Q7 = microbuilder:MOSFET-P: P-Channel Mosfet LEGEND VDS: Voltage Drain-Source ID: Drain Current RDS(ON): Drain-Source On-State Resistance VGS(TH): Gate-Source Threshold Voltage CISS: Drain-Source Input Capacitance SOT-23 Name VDS ID RDS(ON) VGS(TH) CISS Order Number IRLML5103 30V 760mA 600 mOhm -- 75pF @ 25V Digikey: IRLML5103PBFCT-ND IRLML6401 12V 4.3A 50 mOhm 950mV @ 250µA 830pF @ 10V Digikey: IRLML6401PBFTR-ND NTR0202PL 20V 400mA 800 mOhm 2.3V @ 250uA 70pF @ 5V Digikey: NTR0202PLT1GOSTR-ND NTR4101PT1G 20V 1.8A 85 mOhm 1.2V @ 250uA 675pF @ 10V Digikey: NTR4101PT1GOSCT-ND DMP2004K 20V 600mA 900 mOhm 1V @ 250uA 175pF @ 16V Digikey: DMP2004KDICT-ND PMV65XP 20V 3.9A 76 mOhm 950mV @ 1mA 725pF @ 20V Digikey: 568-2358-2-ND TO-252 Name VDS ID RDS(ON) VGS(TH) CISS Order Number AOD417 30V 25A 34 mOhm 3V @ 250µA 920pF @ 15V Digikey: 785-1106-2-ND
R1 R2 = resistor:R-EU_: RESISTOR, European symbol; PARTNO: RC0603FR-0712KL
R3 R10 R12 R13 R19 R24 = resistor:R-EU_: RESISTOR, European symbol; PARTNO: CRCW0603100RFKEAC
R4-R8 R11 R14 R16 R23 R32 R35 R37 R40 R43 R44 R47 R65 = resistor:R-EU_: RESISTOR, European symbol; PARTNO: CRCW06030000Z0EAC
R9 R21 R53 R54 = resistor:R-EU_: RESISTOR, European symbol; PARTNO: CRCW0603100KFKEAC
R15 R18 R22 R25 R42 R49 R64 R67 R68 R70-R78 R83-R90 = resistor:R-EU_: RESISTOR, European symbol; PARTNO: CRCW060310K0JNEAC
R17 R20 R31 R48 R55 R63 = resistor:R-EU_: RESISTOR, European symbol; PARTNO: CRCW060347R0FKEAC
R26 R27 = resistor:R-EU_: RESISTOR, European symbol; PARTNO: CRCW060310R0FKEAC
R28 R50 = resistor:R-EU_: RESISTOR, European symbol; PARTNO: RN73R1JTTD1002D25
R29 R51 = resistor:R-EU_: RESISTOR, European symbol
R30 = resistor:R-EU_: RESISTOR, European symbol; PARTNO: ERJ-PB3D4532V
R33 R34 R36 = resistor:R-EU_: RESISTOR, European symbol; PARTNO: CRCW0603330RFKEAC
R52 = resistor:R-EU_: RESISTOR, European symbol; PARTNO: ERJ-PB3D7322V
R81 R82 = resistor:R-EU_: RESISTOR, European symbol; PARTNO: RCS06032K20JNEA
S1 = adafruit:31-XX: OMRON SWITCH Now with beefier pads!; PARTNO: FSMRA5JH
T1 T2 = transistor-neu-to92:BC847: NPN TRANSISTOR; PARTNO: BC847A-TP
TP1-TP17 TP19-TP21 = testpad:TP: Test pad
U1 = nxp_60:PCA9509: The PCA9509 is a level translating I2C-bus/SMBus repeater with two voltage supplies that enables processor low voltage 2-wire serial bus to interface with standard I2C-bus or SMBus I/O. AAL Eindhoven MK; PARTNO: PCA9509DP,118
U2 = FRA_eagle_lib:ESP-WROOM-32; PARTNO: ESP32-WROOM-32
U$1 U$4 = FRA_eagle_lib:TPS5632149DDCR: TPS563249 17-V, 3-A, Constant 1.4-MHz Synchronous Step-Down Voltage Regulator datasheet <http://www.ti.com/lit/ds/symlink/tps563249.pdf> • Input Voltage Range: 4.5 V to 17 V • Output Voltage Range: 0.6 V to 7 V The TPS563249 is a simple, easy-to-use, 3 A synchronous step-down converter in SOT-23 package. The device is optimized to operate with minimum external component counts and also optimized to achieve low standby current. This switching regulator employs D-CAP3 mode control providing a fast transient response and supporting both low-equivalent series resistance (ESR) output capacitors such as specialty polymer and ultra-low ESR ceramic capacitors with no external compensation components. TPS563249 operates in Forced Continuous Conduction Mode (FCCM), which maintains fixed 1.4 MHz switching frequency during light load operation and eliminates system interference. The TPS563249 is available in a 6-pin 1.6-mm × 2.9-mm SOT (DDC) package, and specified from a –40°C to 125°C junction temperature.; PARTNO: TPS563249DDCR
U$2 = FRA_eagle_lib:HEADER_3X6P_ESPPROG; PARTNO: HTMS-103-03-T-D-SM
U$3 U$8-U$16 = FRA_eagle_lib:CONN_03X2_WE_61200621621: https://eu.mouser.com/ProductDetail/Wurth-Elektronik/61200621621?qs=sGAEpiMZZMs%252BGHln7q6pm%2FFhW%252BtWvhAgbNxkR%252BlwXp8Ip%2FAN9J9VOg%3D%3D https://eu.mouser.com/datasheet/2/445/6120xx21621-265830.pdf; PARTNO: 61200621621
U$7 = FRA_eagle_lib:ETH_MODULE_OUTLINE
X1 = con-wago-500:W237-102: WAGO SCREW CLAMP; MPN: 237-102; OC_FARNELL: unknown; OC_NEWARK: 70K9898; PARTNO: TB001-500-02BE
Y3 = SparkFun-Clocks:CRYSTAL-32.768KHZ: 32.768kHz Crystal Frequency: 32.768kHz Frequency Stability: ±20ppm Load Capacitance: 12.5pF (PTH-2X6 & SMD-3.2X1.5), 6pF (SMD-2X6) SparkFun Products: SparkFun BigTime Watch Kit <https://www.sparkfun.com/products/11734> SparkFun nRF52832 Breakout <https://www.sparkfun.com/products/13990> SparkFun Real Time Clock Module <https://www.sparkfun.com/products/12708>; PARTNO: FC-135 32.7680KA-A3; PROD_ID: XTAL-13062; VALUE: 32.768kHz